# Altium schematic sheet ADC.SchDoc
size A3; DocumentNumber: 6; SheetNumber: 6; SheetTotal: 9
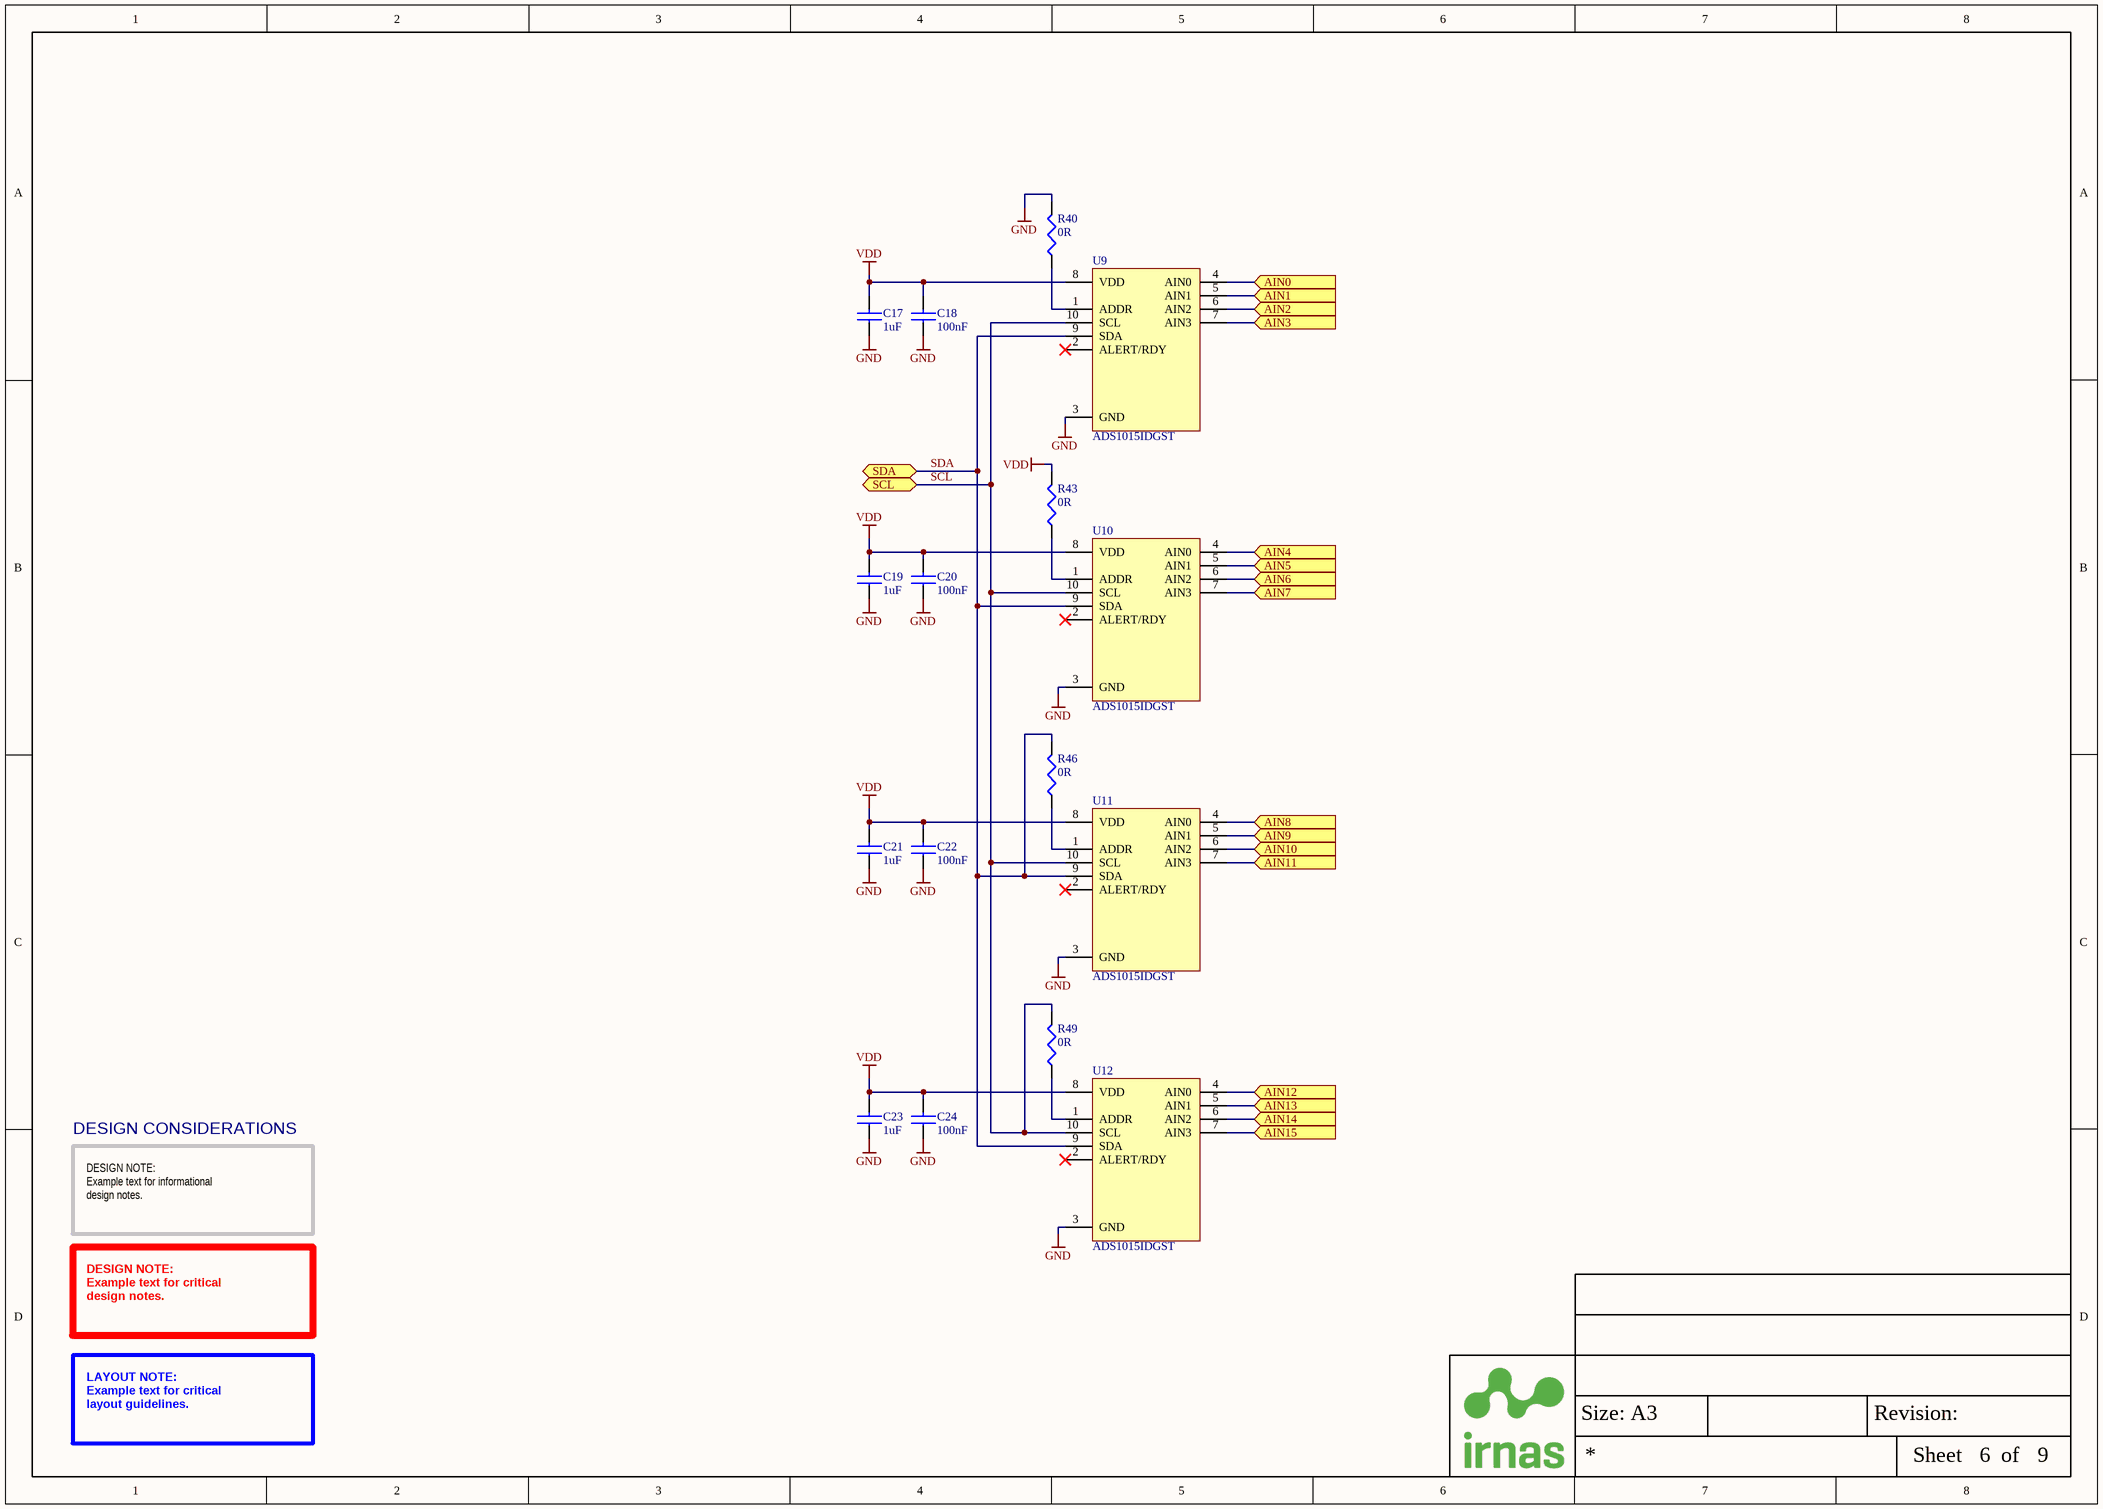
[diagram p0: ADC.SchDoc]

## Parts
C17  1uF  [CAP0402]
C18  100nF  [CAP0402]
C19  1uF  [CAP0402]
C20  100nF  [CAP0402]
C21  1uF  [CAP0402]
C22  100nF  [CAP0402]
C23  1uF  [CAP0402]
C24  100nF  [CAP0402]
R40  0R  [RES0402]
R43  0R  [RES0402]
R46  0R  [RES0402]
R49  0R  [RES0402]
U9  ADS1015IDGST  [VSSOP-10]
U10  ADS1015IDGST  [VSSOP-10]
U11  ADS1015IDGST  [VSSOP-10]
U12  ADS1015IDGST  [VSSOP-10]

## Ports
AIN0 (in), AIN1 (in), AIN2 (in), AIN3 (in), AIN4 (in), AIN5 (in), AIN6 (in), AIN7 (in), AIN8 (in), AIN9 (in), AIN10 (in), AIN11 (in), AIN12 (in), AIN13 (in), AIN14 (in), AIN15 (in), SCL (bidir), SDA (bidir)

## Nets
GND: C17.1 C18.1 C19.1 C20.1 C21.1 C22.1 C23.1 C24.1 R40.2 U9.3(GND) U10.3(GND) U11.3(GND) U12.3(GND)
VDD: C17.2 C18.2 C19.2 C20.2 C21.2 C22.2 C23.2 C24.2 R43.2 U9.8(VDD) U10.8(VDD) U11.8(VDD) U12.8(VDD)
AIN0: U9.4(AIN0) ; port AIN0
AIN1: U9.5(AIN1) ; port AIN1
AIN2: U9.6(AIN2) ; port AIN2
AIN3: U9.7(AIN3) ; port AIN3
AIN4: U10.4(AIN0) ; port AIN4
AIN5: U10.5(AIN1) ; port AIN5
AIN6: U10.6(AIN2) ; port AIN6
AIN7: U10.7(AIN3) ; port AIN7
AIN8: U11.4(AIN0) ; port AIN8
AIN9: U11.5(AIN1) ; port AIN9
AIN10: U11.6(AIN2) ; port AIN10
AIN11: U11.7(AIN3) ; port AIN11
AIN12: U12.4(AIN0) ; port AIN12
AIN13: U12.5(AIN1) ; port AIN13
AIN14: U12.6(AIN2) ; port AIN14
AIN15: U12.7(AIN3) ; port AIN15
SCL: R49.2 U9.10(SCL) U10.10(SCL) U11.10(SCL) U12.10(SCL) ; port SCL
SDA: R46.2 U9.9(SDA) U10.9(SDA) U11.9(SDA) U12.9(SDA) ; port SDA
NetR40_1: R40.1 U9.1(ADDR)
NetR43_1: R43.1 U10.1(ADDR)
NetR46_1: R46.1 U11.1(ADDR)
NetR49_1: R49.1 U12.1(ADDR)

Not connected (* = marked no-connect by the designer): U9 2(ALERT/RDY)*; U10 2(ALERT/RDY)*; U11 2(ALERT/RDY)*; U12 2(ALERT/RDY)*

## Notes on the sheet
- DESIGN CONSIDERATIONS
- DESIGN NOTE:
  Example text for informational
  design notes.
- DESIGN NOTE:
  Example text for critical
  design notes.
- LAYOUT NOTE:
  Example text for critical
  layout guidelines.
- Size: A3
- Revision:
- Sheet
- of

## Library data of the parts
C17 C19 C21 C23 = C - 1uF/0402: CAP CER 1UF 10V 20% X5R 0402; Manufacturer: Murata; Manufacturer Part Number: GRM155R61A105ME15D; IRNAS Part No.: /; Supplier 1: Farnell; Stock 1: 0; Pricing 1: 10=0.0379, 100=0.0266, 500=0.0156, 2500=0.0098, 5000=0.0083 (EUR); Mount: Surface Mount; Case/Package: 0402; Case Code (Metric): 1005; Case Code (Imperial): 0402; Min Operating Temperature: -55°C; Max Operating Temperature: 85°C; Capacitance: 1uF; Tolerance: 20%; Voltage Rating: 10V; Packaging: Tape and Reel; Package Quantity: 1; Dielectric: X5R; Voltage: 10V; Voltage Rating (DC): 10V; Length: 1mm; Height: 0.5mm; Width: 0.02inch; Thickness: 0.022inch; Depth: 0.5mm; Radiation Hardening: No; REACH SVHC: No SVHC; Lead Free: Lead Free; ComponentLink1URL: https://datasheet.ciiva.com/164/product-164665.pdf; ComponentLink1Description: https://datasheet.ciiva.com/164/product-164665.pdf; ComponentLink2URL: https://datasheet.ciiva.com/11616/product-11616508.pdf; ComponentLink2Description: https://datasheet.ciiva.com/11616/product-11616508.pdf; ComponentLink3URL: https://datasheet.ciiva.com/46418/1769893-46418047.pdf; ComponentLink3Description: https://datasheet.ciiva.com/46418/1769893-46418047.pdf; ComponentLink4URL: https://datasheet.ciiva.com/164/partnumbering-e-01-164666.pdf; ComponentLink4Description: https://datasheet.ciiva.com/164/partnumbering-e-01-164666.pdf; ComponentLink5URL: https://datasheet.ciiva.com/164/partnumbering-e-01-164667.pdf; ComponentLink5Description: https://datasheet.ciiva.com/164/partnumbering-e-01-164667.pdf; Supplier Part Number 1: 2426953
C18 C20 C22 C24 = C - 100nF/0402: MULTICOMP         MC0402X104J160CT             SMD Multilayer Ceramic Capacitor, 0402 [1005 Metric], 0.1 F, 16 V,  5%, X5R, MC Series                          New; IRNAS Part No.: /; Voltage Rating: 16V; Supplier 1: Farnell; Manufacturer: Multicomp; Manufacturer Part Number: MC0402X104J160CT; Stock 1: 3230; Pricing 1: 10=0.0139, 100=0.0108, 500=0.0076, 2500=0.0051, 5000=0.0038 (EUR); Case Code (Metric): 1005; Case Code (Imperial): 0402; Min Operating Temperature: -55°C; Max Operating Temperature: 85°C; Capacitance: 100nF; Dielectric: X5R; Packaging: Tape and Reel; Tolerance: 5%; Voltage Rating (DC): 16V; REACH SVHC: No SVHC; ComponentLink1URL: http://www.farnell.com/datasheets/2117933.pdf; ComponentLink1Description: http://www.farnell.com/datasheets/2117933.pdf; ComponentLink2URL: http://www.farnell.com/datasheets/2117900.pdf; ComponentLink2Description: http://www.farnell.com/datasheets/2117900.pdf; Supplier Part Number 1: 2627419
R40 R43 R46 R49 = R - 0R/0402: RESISTOR, 0402, 0R, ANTI SULFURATION; Manufacturer: Multicomp; Manufacturer Part Number: MCMR04X000PTL; IRNAS Part No.: I-100016; Voltage Rating: 50V; Resistance: 0mR; Power Rating: 62.5mW; Temperature Coefficient: 400ppm/°C; Supplier 1: Farnell; Stock 1: 0; Pricing 1: 10=0.0057, 100=0.0034, 500=0.0024, 2500=0.0019, 5000=0.0015 (EUR); Case/Package: 0402; Case Code (Metric): 1005; Case Code (Imperial): 0402; Packaging: Cut Tape; Composition: Ceramic; Voltage Rating (DC): 50V; REACH SVHC: No SVHC; ComponentLink1URL: https://datasheet.ciiva.com/7776/1716705-7776974.pdf; ComponentLink1Description: https://datasheet.ciiva.com/7776/1716705-7776974.pdf; ComponentLink2URL: https://datasheet.ciiva.com/28677/1716705-28677161.pdf; ComponentLink2Description: https://datasheet.ciiva.com/28677/1716705-28677161.pdf; Supplier Part Number 1: 2072513
U9-U12 = ADC - ADS1015IDGST: Analogue to Digital Converter, 12 bit, 3.3 kSPS, Differential, Single Ended, I2C, Single; Manufacturer: TEXAS INSTRUMENTS; ComponentLink1Description: Datasheet; ComponentLink1URL: https://www.nxp.com/docs/en/data-sheet/PCF8591.pdf; Supplier 1: Farnell; Supplier Part Number 1: 3116553; Manufacturer Part Number: ADS1015IDGST